# Altium schematic sheet PCB_esp32扩展板.schdoc
size 416 x 209 mm
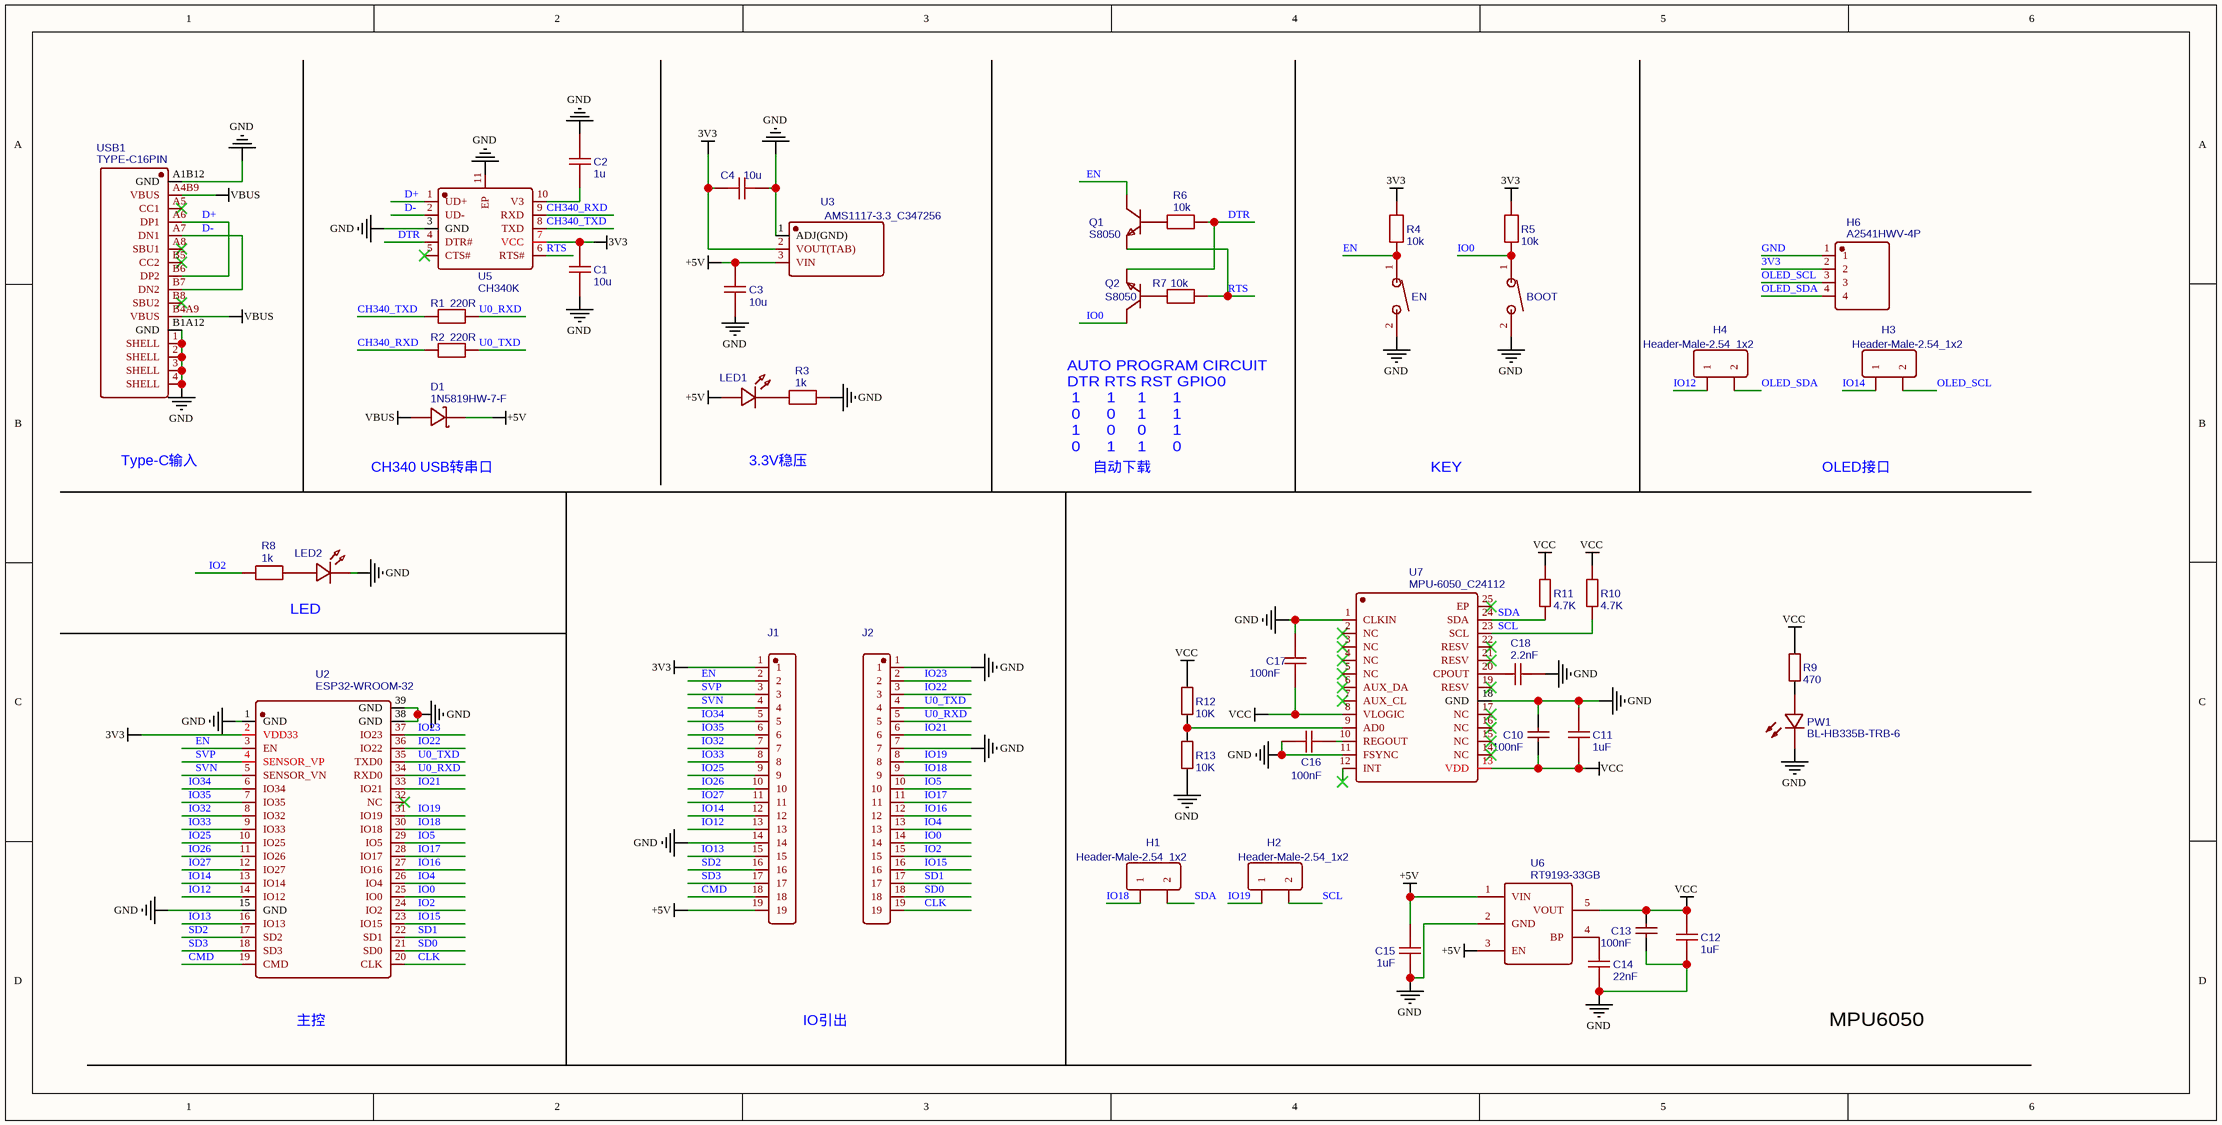
[diagram p0: PCB_esp32扩展板.schdoc]

## Parts
BOOT  TSA343G00D-250J2  [SW-SMD_L4.0-W2.9-P4.15-EH]  (value not drawn)
C1  10u  [C0603]
C2  1u  [C0603]
C3  10u  [C0603]
C4  10u  [C0603]
C10  100nF  [C0603]
C11  1uF  [C0603]
C12  1uF  [C0603]
C13  100nF  [C0603]
C14  22nF  [C0603]
C15  1uF  [C0603]
C16  100nF  [C0603]
C17  100nF  [C0603]
C18  2.2nF  [C0603]
D1  1N5819HW-7-F  [SOD-123_L2.8-W1.8-LS3.7-FD]
EN  TSA343G00D-250J2  [SW-SMD_L4.0-W2.9-P4.15-EH]  (value not drawn)
H1  Header-Male-2.54_1x2  [HDR-TH_2P-P2.54-V-M-1]
H2  Header-Male-2.54_1x2  [HDR-TH_2P-P2.54-V-M-1]
H3  Header-Male-2.54_1x2  [HDR-TH_2P-P2.54-V-M-1]
H4  Header-Male-2.54_1x2  [HDR-TH_2P-P2.54-V-M-1]
H6  A2541HWV-4P  [HDR-TH_4P-P2.54-V_A2541HWV-4P]
J1  Header-Male-2.54_1x19  [HDR-TH_19P-P2.54-V-M]  (value not drawn)
J2  Header-Male-2.54_1x19  [HDR-TH_19P-P2.54-V-M]  (value not drawn)
LED1  LED-0603_R  [LED0603_RED]  (value not drawn)
LED2  LED-0603_R  [LED0603_RED]  (value not drawn)
PW1  BL-HB335B-TRB-6  [LED0805-RD]
Q1  S8050  [SOT-23-3_L2.9-W1.3-P1.90-LS2.4-BR]
Q2  S8050  [SOT-23-3_L2.9-W1.3-P1.90-LS2.4-BR]
R1  220R  [R0603]
R2  220R  [R0603]
R3  1k  [R0603]
R4  10k  [R0603]
R5  10k  [R0603]
R6  10k  [R0603]
R7  10k  [R0603]
R8  1k  [R0603]
R9  470  [R0805]
R10  4.7K  [R0805]
R11  4.7K  [R0805]
R12  10K  [R0805]
R13  10K  [R0805]
U2  ESP32-WROOM-32  [WIFIM-SMD_39P-L25.5-W18.0-P1.27]
U3  AMS1117-3.3_C347256  [SOT-89_L4.5-W2.5-P1.50-LS4.2-BR]
U5  CH340K  [ESOP-10_L4.9-W3.9-P1.00-LS6.2-BL-EP]
U6  RT9193-33GB  [SOT-23-5_L3.0-W1.7-P0.95-LS2.8-BL]
U7  MPU-6050_C24112  [QFN-24_L4.0-W4.0-P0.50-BL-EP2.6]
USB1  TYPE-C16PIN  [USB-C-SMD_TYPE-C16PIN]

## Nets
3V3: C1.2 C4.1 H6.2 J1.1 R4.2 R5.2 U2.2(VDD33) U3.2(VOUT(TAB)) U5.7(VCC)
+5V: C3.1 C15.1 D1.2(K) J1.19 LED1.1 U3.3(VIN) U6.1(VIN) U6.3(EN)
GND: BOOT.2 C1.1 C2.2 C3.2 C4.2 C10.2 C11.1 C12.2 C13.1 C14.2 C15.2 C16.2 C17.2 C18.1 EN.2 H6.1 J1.14 J2.1 J2.7 LED2.2 PW1.1(C) R3.2 R13.2 U2.1(GND) U2.15(GND) U2.38(GND) U2.39(GND) U3.1(ADJ(GND)) U5.3(GND) U5.11(EP) U6.2(GND) U7.1(CLKIN) U7.11(FSYNC) U7.18(GND) USB1.1(SHELL) USB1.2(SHELL) USB1.3(SHELL) USB1.4(SHELL) USB1.A1B12(GND) USB1.B1A12(GND)
VBUS: D1.1(A) USB1.A4B9(VBUS) USB1.B4A9(VBUS)
VCC: C10.1 C11.2 C12.1 C13.2 C17.1 R9.2 R10.2 R11.2 R12.1 U6.5(VOUT) U7.8(VLOGIC) U7.13(VDD)
CH340_RXD: R2.1 U5.9(RXD)
CH340_TXD: R1.1 U5.8(TXD)
CLK: J2.19 U2.20(CLK)
CMD: J1.18 U2.19(CMD)
D+: U5.1(UD+) USB1.A6(DP1) USB1.B6(DP2)
D-: U5.2(UD-) USB1.A7(DN1) USB1.B7(DN2)
DTR: Q2.2(E) R6.2 U5.4(DTR#)
EN: EN.1 J1.2 Q1.3(C) R4.1 U2.3(EN)
IO0: BOOT.1 J2.14 Q2.3(C) R5.1 U2.25(IO0)
IO2: J2.15 R8.1 U2.24(IO2)
IO4: J2.13 U2.26(IO4)
IO5: J2.10 U2.29(IO5)
IO12: H4.1 J1.13 U2.14(IO12)
IO13: J1.15 U2.16(IO13)
IO14: H3.1 J1.12 U2.13(IO14)
IO15: J2.16 U2.23(IO15)
IO16: J2.12 U2.27(IO16)
IO17: J2.11 U2.28(IO17)
IO18: H1.1 J2.9 U2.30(IO18)
IO19: H2.1 J2.8 U2.31(IO19)
IO21: J2.6 U2.33(IO21)
IO22: J2.3 U2.36(IO22)
IO23: J2.2 U2.37(IO23)
IO25: J1.9 U2.10(IO25)
IO26: J1.10 U2.11(IO26)
IO27: J1.11 U2.12(IO27)
IO32: J1.7 U2.8(IO32)
IO33: J1.8 U2.9(IO33)
IO34: J1.5 U2.6(IO34)
IO35: J1.6 U2.7(IO35)
OLED_SCL: H3.2 H6.3
OLED_SDA: H4.2 H6.4
RTS: Q1.2(E) R7.2 U5.6(RTS#)
SCL: H2.2 R10.1 U7.23(SCL)
SD0: J2.18 U2.21(SD0)
SD1: J2.17 U2.22(SD1)
SD2: J1.16 U2.17(SD2)
SD3: J1.17 U2.18(SD3)
SDA: H1.2 R11.1 U7.24(SDA)
SVN: J1.4 U2.5(SENSOR_VN)
SVP: J1.3 U2.4(SENSOR_VP)
U0_RXD: J2.5 R1.2 U2.34(RXD0)
U0_TXD: J2.4 R2.2 U2.35(TXD0)
NetC2_1: C2.1 U5.10(V3)
NetC14_1: C14.1 U6.4(BP)
NetC16_1: C16.1 U7.10(REGOUT)
NetC18_2: C18.2 U7.20(CPOUT)
NetLED1_2: LED1.2 R3.1
NetLED2_1: LED2.1 R8.2
NetPW1_2: PW1.2(A) R9.1
NetQ1_1: Q1.1(B) R6.1
NetQ2_1: Q2.1(B) R7.1
NetR12_2: R12.2 R13.1 U7.9(AD0)

Not connected (* = marked no-connect by the designer): U2 32(NC)*; U5 5(CTS#)*; U7 2(NC)* 3(NC)* 4(NC)* 5(NC)* 6(AUX_DA)* 7(AUX_CL)* 12(INT)* 14(NC)* 15(NC)* 16(NC)* 17(NC)* 19(RESV)* 21(RESV)* 22(RESV)* 25(EP)*; USB1 A5(CC1)* A8(SBU1)* B5(CC2)* B8(SBU2)*

## Notes on the sheet
- AUTO PROGRAM CIRCUIT
  DTR RTS RST GPIO0
  1      1     1      1
  0      0     1      1
  1      0     0      1
  0      1     1      0
- Type-C输入
- (near D1) CH340 USB转串口
- 3.3V稳压
- 自动下载
- KEY
- OLED接口
- LED
- (near U2) 主控
- IO引出
- MPU6050

## Library data of the parts
BOOT EN = TSA343G00D-250J2: BOM_Manufacturer: BRIGHT; Contributor: LCSC; BOM_Paste Type: expand; BOM_Assembly Type: smtWeld; BOM_Supplier: LCSC; BOM_Supplier Part: C354947; BOM_Manufacturer Part: TSA343G00D-250J2; spicePre: S; spiceSymbolName: TSA343G00D-250J2
C1 C3 C4 = 10u: nameAlias: Value(F); Contributor: LCEDA_Lib; spicePre: C; spiceSymbolName: C_0603_US
C2 = 1u: nameAlias: Value(F); Contributor: LCEDA_Lib; spicePre: C; spiceSymbolName: C_0603_US
C10 C13 = 100nF: BOM_Manufacturer: TORCH; BOM_Manufacturer Part: CT41G-0603-2X1-50V-0.1μF-K(N); nameAlias: Capacitance; Contributor: LCSC; BOM_Supplier: LCSC; BOM_Supplier Part: C125205; spicePre: C; spiceSymbolName: CT41G-0603-2X1-50V-0.1μF-K(N)
C11 C12 C15 = 1uF: BOM_Manufacturer: Murata Electronics; BOM_Manufacturer Part: GRM185R61E105KA12D; nameAlias: Capacitance; Contributor: LCSC; BOM_Supplier: LCSC; BOM_Supplier Part: C162200; spicePre: C; spiceSymbolName: GRM185R61E105KA12D
C14 = 22nF: BOM_Manufacturer: Walsin Tech Corp; BOM_Manufacturer Part: 0603B223K500CT; nameAlias: Capacitance; Contributor: LCSC; BOM_Supplier: LCSC; BOM_Supplier Part: C302021; spicePre: C; spiceSymbolName: 0603B223K500CT
C16 C17 = 100nF: BOM_Manufacturer: YAGEO; BOM_Manufacturer Part: CC0603KRX7R9BB104; nameAlias: Capacitance; SMT Type: Basic; BOM_Supplier: LCSC; BOM_LCSC Assembly: Yes; BOM_Supplier Part: C14663; spicePre: C; spiceSymbolName: CC0603KRX7R9BB104
C18 = 2.2nF: BOM_Manufacturer: YAGEO; BOM_Manufacturer Part: CS0603KRX7R9BB222; nameAlias: Capacitance; Contributor: LCSC; BOM_Supplier: LCSC; BOM_Supplier Part: C309517; spicePre: C; spiceSymbolName: CS0603KRX7R9BB222
D1 = 1N5819HW-7-F: BOM_Manufacturer: DIODES; BOM_Paste Type: expand; BOM_Assembly Type: smtWeld; BOM_Supplier: LCSC; BOM_Manufacturer Part: 1N5819HW-7-F; image: //image.lceda.cn/szlcsc/C82544.jpg; BOM_Supplier Part: C82544; spicePre: D; spiceSymbolName: 1N5819HW-7-F
H1-H4 = Header-Male-2.54_1x2: BOM_Manufacturer: TE Connectivity; BOM_Manufacturer Part: 826629-2; BOM_Supplier: LCSC; BOM_Supplier Part: C86471; BOM_JLCPCB Part Class: Extended Part; spicePre: H; spiceSymbolName: Header-Male-2.54_1x2
H6 = A2541HWV-4P: BOM_Manufacturer: Changjiang Connectors; Contributor: LCSC; BOM_Supplier: LCSC; BOM_Supplier Part: C225501; BOM_Manufacturer Part: A2541HWV-4P; BOM_JLCPCB Part Class: Extended Part; spicePre: H; spiceSymbolName: A2541HWV-4P
J1 J2 = Header-Male-2.54_1x19: BOM_Manufacturer: BOOMELE; BOM_Manufacturer Part: 2.54mm 1*20PHeader; Contributor: shiyindebcd; Package Display: No; BOM_Supplier: LCSC; image: //image.lceda.cn/szlcsc/C50981.jpg; BOM_Supplier Part: C50981; spicePre: J; spiceSymbolName: Header-Male-2.54_1x19
LED1 LED2 = LED-0603_R: BOM_Manufacturer: EVERLIGHT(台湾亿光); BOM_Manufacturer Part: 19-217/R6C-AL1M2VY/3T; Contributor: LCEDA_01; BOM_Supplier Part: C72044; BOM_Supplier: LCSC; spicePre: L; spiceSymbolName: LED-0603_R
PW1 = BL-HB335B-TRB-6: BOM_Manufacturer: Bright LED Elec; Contributor: LCSC; SMT Type: Extend; BOM_Supplier: LCSC; BOM_Supplier Part: C189307; BOM_Manufacturer Part: BL-HB335B-TRB-6; BOM_LCSC Assembly: Yes; spicePre: L; spiceSymbolName: BL-HB335B-TRB-6
Q1 Q2 = S8050: BOM_Manufacturer: WPMtek(维攀微); Contributor: LCSC; BOM_Supplier: LCSC; BOM_Supplier Part: C2688231; BOM_Manufacturer Part: S8050; spicePre: Q; spiceSymbolName: S8050
R1 R2 = 220R: nameAlias: Value(Ω); Contributor: LCEDA_Lib; spicePre: R; spiceSymbolName: R_0603_EU
R3 R8 = 1k: nameAlias: Value(Ω); Contributor: LCEDA_Lib; spicePre: R; spiceSymbolName: R_0603_EU
R4-R7 = 10k: nameAlias: Value(Ω); Contributor: LCEDA_Lib; spicePre: R; spiceSymbolName: R_0603_EU
R9 = 470: BOM_Manufacturer: LIZ; BOM_Manufacturer Part: CR0805J80471G; nameAlias: Resistance (Ohms); BOM_Supplier: LCSC; BOM_Supplier Part: C102016; spicePre: R; spiceSymbolName: CR0805J80471G
R10 R11 = 4.7K: BOM_Manufacturer: Tyohm; BOM_Manufacturer Part: RMC08054.7K1%N; nameAlias: Resistance (Ohms); Contributor: LCSC; BOM_Supplier: LCSC; BOM_Supplier Part: C269746; spicePre: R; spiceSymbolName: RMC08054.7K1%N
R12 R13 = 10K: BOM_Manufacturer: WTC; BOM_Manufacturer Part: WR08X1002FTL; nameAlias: Resistance (Ohms); BOM_Supplier: LCSC; BOM_Supplier Part: C108451; spicePre: R; spiceSymbolName: WR08X1002FTL
U2 = ESP32-WROOM-32: BOM_Manufacturer: Espressif Systems; Contributor: LCSC; BOM_Supplier: LCSC; BOM_Supplier Part: C503587; BOM_Manufacturer Part: ESP32-WROOM-32; spicePre: U; spiceSymbolName: ESP32-WROOM-32
U3 = AMS1117-3.3_C347256: BOM_Manufacturer: Youtai Semiconductor Co., Ltd.; Contributor: LCSC; BOM_Paste Type: expand; BOM_Assembly Type: smtWeld; BOM_Supplier: LCSC; BOM_Supplier Part: C347256; BOM_Manufacturer Part: AMS1117-3.3; spicePre: U; spiceSymbolName: AMS1117-3.3_C347256
U5 = CH340K: BOM_Manufacturer: WCH(Jiangsu Qin Heng); Contributor: LCSC; BOM_Supplier: LCSC; BOM_Supplier Part: C968586; BOM_Manufacturer Part: CH340K; BOM_JLCPCB Part Class: Extended Part; spicePre: U; spiceSymbolName: CH340K
U6 = RT9193-33GB: BOM_Manufacturer: RICHTEK; SMT Type: Extend; BOM_Supplier: LCSC; BOM_Manufacturer Part: RT9193-33GB; image: //image.lceda.cn/szlcsc/C15651.jpg; BOM_Supplier Part: C15651; BOM_LCSC Assembly: Yes; spicePre: U; spiceSymbolName: RT9193-33GB
U7 = MPU-6050_C24112: BOM_Manufacturer: InvenSense; sourceId: 1T5FDZYC8; SMT Type: Basic; timeStamp: 1462265206; BOM_Supplier: LCSC; BOM_Manufacturer Part: MPU-6050; BOM_LCSC Assembly: Yes; image: //image.lceda.cn/szlcsc/C24112.jpg; BOM_Supplier Part: C24112; spicePre: U; spiceSymbolName: MPU-6050_C24112
USB1 = TYPE-C16PIN: BOM_Manufacturer: SHOU HAN; Contributor: LCSC; BOM_Supplier: LCSC; BOM_Supplier Part: C393939; BOM_Manufacturer Part: TYPE-C16PIN; spicePre: U; spiceSymbolName: TYPE-C16PIN